# Altium schematic sheet FRONT_LCD.SchDoc: SDR200
size 420 x 297 mm; DocumentNumber: XXXX.468179.001 Э3; SheetNumber: 3; SheetTotal: 7; Title2str: Передняя панель; DocumentType: Схема электрическая принципиальная; Scale: 1:1
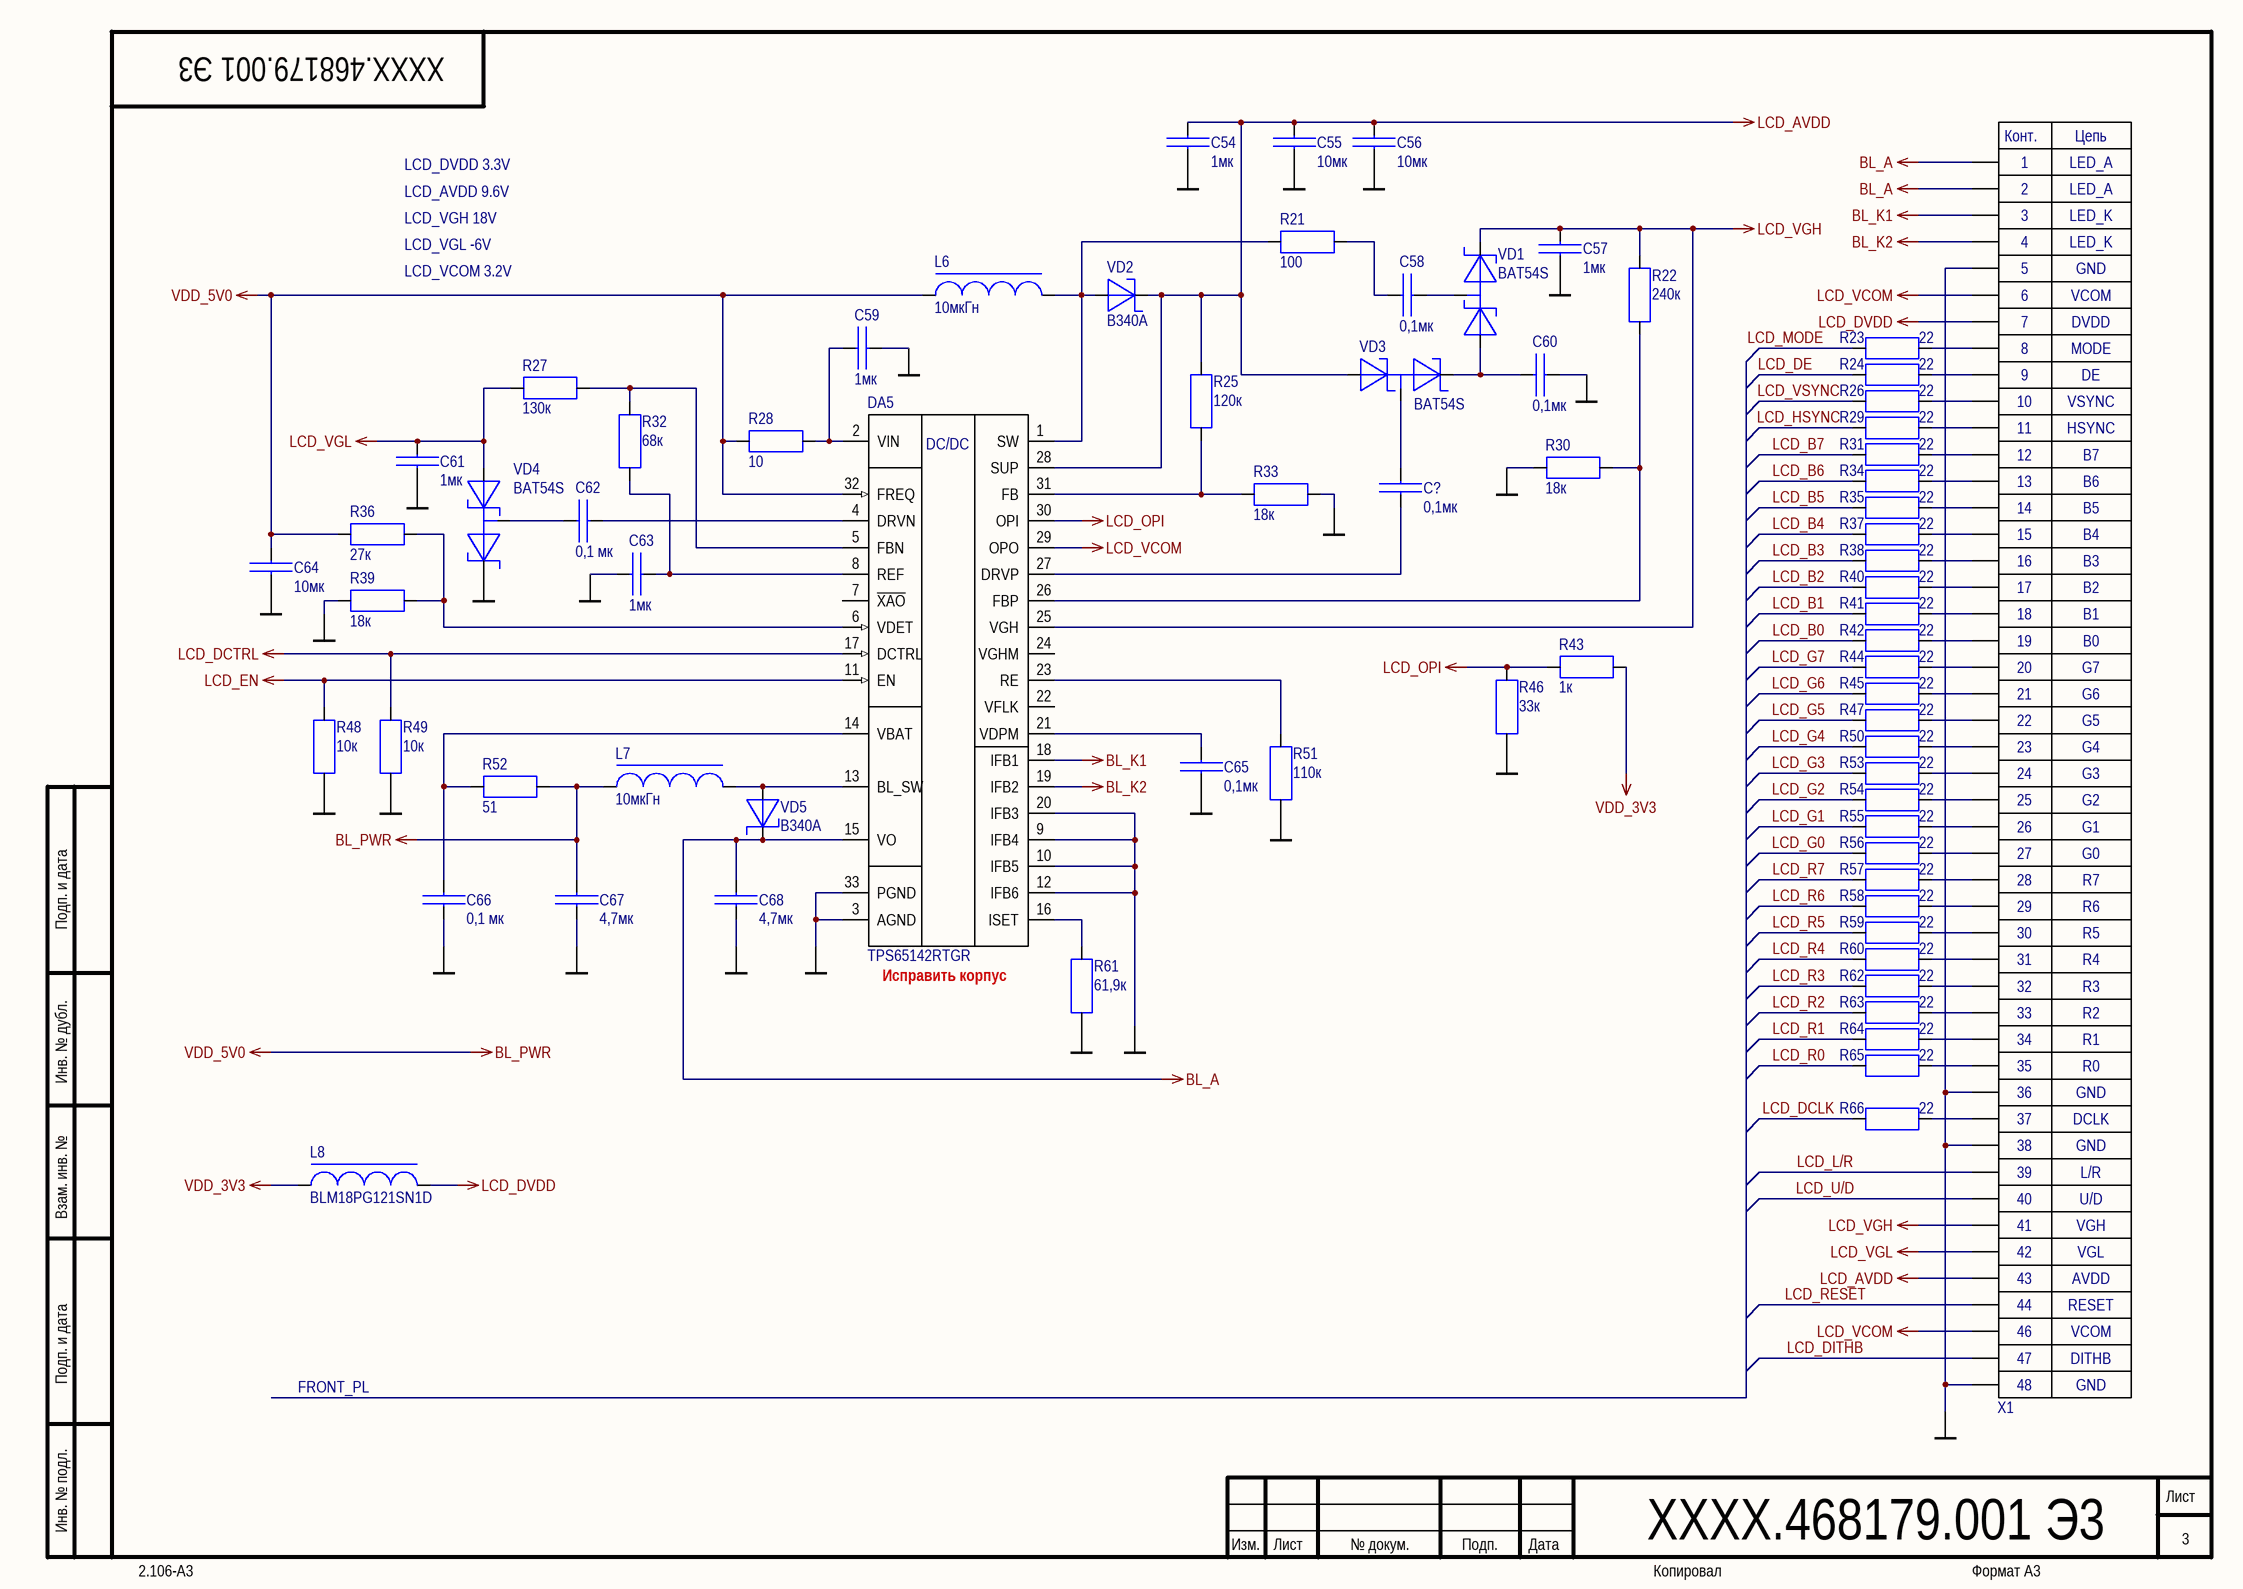
[diagram p0: FRONT_LCD.SchDoc]

## Parts
C54  Nominal: 1мк  [CAPC1608X08L]  (hidden comment: CC0603KRX7R9BB105)
C55  Nominal: 10мк  [CAPC2012X09L]  (hidden comment: CC0805KKX5R8BB106)
C56  Nominal: 10мк  [CAPC2012X09L]  (hidden comment: CC0805KKX5R8BB106)
C57  Nominal: 1мк  [CAPC1608X08L]  (hidden comment: CC0603KRX7R9BB105)
C58  Nominal: 0,1мк  [CAPC1608X08L]  (hidden comment: CC0603KRX7R9BB103)
C59  Nominal: 1мк  [CAPC1608X08L]  (hidden comment: CC0603KRX7R9BB105)
C60  Nominal: 0,1мк  [CAPC1608X08L]  (hidden comment: CC0603KRX7R9BB103)
C61  Nominal: 1мк  [CAPC1608X08L]  (hidden comment: CC0603KRX7R9BB105)
C62  Nominal: 0,1 мк  [CAPC1005X05L]  (hidden comment: CC0402KRX5R6BB104)
C63  Nominal: 1мк  [CAPC1608X08L]  (hidden comment: CC0603KRX7R9BB105)
C64  Nominal: 10мк  [CAPC2012X09L]  (hidden comment: CC0805KKX5R8BB106)
C65  Nominal: 0,1мк  [CAPC1608X08L]  (hidden comment: CC0603KRX7R9BB103)
C66  Nominal: 0,1 мк  [CAPC1005X05L]  (hidden comment: CC0402KRX5R6BB104)
C67  Nominal: 4,7мк  [CAPC2012X09L]  (hidden comment: CC0805KKX7R8BB475)
C68  Nominal: 4,7мк  [CAPC2012X09L]  (hidden comment: CC0805KKX7R8BB475)
C?  Nominal: 0,1мк  [CAPC1608X08L]  (hidden comment: CC0603KRX7R9BB103)
DA5  TPS65142RTGR  [PQFN40P600X300X80_HS-33N]
L6  Nominal: 10мкГн  [INDC1812PS]  (hidden comment: 1812PS-103KR)
L7  Nominal: 10мкГн  [INDC1812PS]  (hidden comment: 1812PS-103KR)
L8  BLM18PG121SN1D  [INDC1608X05L]
R21  Nominal: 100  [RESC1005X04L]  (hidden comment: RC0402JR-07100RL)
R22  Nominal: 240к  [RESC1005X04L]  (hidden comment: RC0402JR-07240KL)
R23  Nominal: 22  [RESC1005X04L]  (hidden comment: RC0402JR-0722RL)
R24  Nominal: 22  [RESC1005X04L]  (hidden comment: RC0402JR-0722RL)
R25  Nominal: 120к  [RESC1005X04L]  (hidden comment: RC0402JR-07120KL)
R26  Nominal: 22  [RESC1005X04L]  (hidden comment: RC0402JR-0722RL)
R27  Nominal: 130к  [RESC1005X04L]  (hidden comment: RC0402JR-07130KL)
R28  Nominal: 10  [RESC1005X04L]  (hidden comment: RC0402JR-0710RL)
R29  Nominal: 22  [RESC1005X04L]  (hidden comment: RC0402JR-0722RL)
R30  Nominal: 18к  [RESC1005X04L]  (hidden comment: RC0402JR-0718KL)
R31  Nominal: 22  [RESC1005X04L]  (hidden comment: RC0402JR-0722RL)
R32  Nominal: 68к  [RESC1005X04L]  (hidden comment: RC0402JR-0768KL)
R33  Nominal: 18к  [RESC1005X04L]  (hidden comment: RC0402JR-0718KL)
R34  Nominal: 22  [RESC1005X04L]  (hidden comment: RC0402JR-0722RL)
R35  Nominal: 22  [RESC1005X04L]  (hidden comment: RC0402JR-0722RL)
R36  Nominal: 27к  [RESC1005X04L]  (hidden comment: RC0402JR-0727KL)
R37  Nominal: 22  [RESC1005X04L]  (hidden comment: RC0402JR-0722RL)
R38  Nominal: 22  [RESC1005X04L]  (hidden comment: RC0402JR-0722RL)
R39  Nominal: 18к  [RESC1005X04L]  (hidden comment: RC0402JR-0718KL)
R40  Nominal: 22  [RESC1005X04L]  (hidden comment: RC0402JR-0722RL)
R41  Nominal: 22  [RESC1005X04L]  (hidden comment: RC0402JR-0722RL)
R42  Nominal: 22  [RESC1005X04L]  (hidden comment: RC0402JR-0722RL)
R43  Nominal: 1к  [RESC1005X04L]  (hidden comment: RC0402JR-071KL)
R44  Nominal: 22  [RESC1005X04L]  (hidden comment: RC0402JR-0722RL)
R45  Nominal: 22  [RESC1005X04L]  (hidden comment: RC0402JR-0722RL)
R46  Nominal: 33к  [RESC1005X04L]  (hidden comment: RC0402JR-0733KL)
R47  Nominal: 22  [RESC1005X04L]  (hidden comment: RC0402JR-0722RL)
R48  Nominal: 10к  [RESC1005X04L]  (hidden comment: RC0402JR-0710KL)
R49  Nominal: 10к  [RESC1005X04L]  (hidden comment: RC0402JR-0710KL)
R50  Nominal: 22  [RESC1005X04L]  (hidden comment: RC0402JR-0722RL)
R51  Nominal: 110к  [RESC1005X04L]  (hidden comment: RC0402JR-07110KL)
R52  Nominal: 51  [RESC1005X04L]  (hidden comment: RC0402JR-0751RL)
R53  Nominal: 22  [RESC1005X04L]  (hidden comment: RC0402JR-0722RL)
R54  Nominal: 22  [RESC1005X04L]  (hidden comment: RC0402JR-0722RL)
R55  Nominal: 22  [RESC1005X04L]  (hidden comment: RC0402JR-0722RL)
R56  Nominal: 22  [RESC1005X04L]  (hidden comment: RC0402JR-0722RL)
R57  Nominal: 22  [RESC1005X04L]  (hidden comment: RC0402JR-0722RL)
R58  Nominal: 22  [RESC1005X04L]  (hidden comment: RC0402JR-0722RL)
R59  Nominal: 22  [RESC1005X04L]  (hidden comment: RC0402JR-0722RL)
R60  Nominal: 22  [RESC1005X04L]  (hidden comment: RC0402JR-0722RL)
R61  Nominal: 61,9к  [RESC1005X04L]  (hidden comment: RC0402FR-0761K9L)
R62  Nominal: 22  [RESC1005X04L]  (hidden comment: RC0402JR-0722RL)
R63  Nominal: 22  [RESC1005X04L]  (hidden comment: RC0402JR-0722RL)
R64  Nominal: 22  [RESC1005X04L]  (hidden comment: RC0402JR-0722RL)
R65  Nominal: 22  [RESC1005X04L]  (hidden comment: RC0402JR-0722RL)
R66  Nominal: 22  [RESC1005X04L]  (hidden comment: RC0402JR-0722RL)
VD1  BAT54S  [SOT95P240X120-3L]
VD2  B340A  [DIOM5127X23L]
VD3  BAT54S  [SOT95P240X120-3L]
VD4  BAT54S  [SOT95P240X120-3L]
VD5  B340A  [DIOM5127X23L]
X1  LCD 50p  [CON_541325062_MOL]  (value not drawn)

## Nets
BL_A: C68.2 DA5.15(VO) VD5.1(K) X1.1 X1.2
BL_K1: DA5.18(IFB1) X1.3
BL_K2: DA5.19(IFB2) X1.4
BL_PWR: C64.1 C67.2 DA5.32(FREQ) L6.2 L7.2 R28.1 R36.1 R52.1  [also labelled VDD_5V0]
GND: C54.1 C55.2 C56.2 C57.1 C59.1 C60.2 C61.1 C63.1 C64.2 C65.1 C66.1 C67.1 C68.1 DA5.3(AGND) DA5.9(IFB4) DA5.10(IFB5) DA5.12(IFB6) DA5.20(IFB3) DA5.33(PGND) R30.1 R33.2 R39.1 R46.1 R48.2 R49.2 R51.1 R61.1 VD4.3(K) X1.5 X1.36 X1.38 X1.48
LCD_AVDD: C54.2 C55.1 C56.1 DA5.28(SUP) R25.1 VD2.1(K) VD3.2(A) X1.43
LCD_DCTRL: DA5.17(DCTRL) R49.1
LCD_DVDD: L8.1 X1.7
LCD_EN: DA5.11(EN) R48.1
LCD_OPI: DA5.30(OPI) R43.2 R46.2
LCD_VCOM: DA5.29(OPO) X1.6 X1.46
LCD_VGH: C57.2 DA5.25(VGH) R22.1 VD1.3(K) X1.41
LCD_VGL: C61.2 R27.1 VD4.2(A) X1.42
VDD_3V3: L8.2 R43.1
LCD_B0: R42.2
LCD_B1: R41.2
LCD_B2: R40.2
LCD_B3: R38.2
LCD_B4: R37.2
LCD_B5: R35.2
LCD_B6: R34.2
LCD_B7: R31.2
LCD_DCLK: R66.2
LCD_DE: R24.2
LCD_DITHB: X1.47
LCD_G0: R56.2
LCD_G1: R55.2
LCD_G2: R54.2
LCD_G3: R53.2
LCD_G4: R50.2
LCD_G5: R47.2
LCD_G6: R45.2
LCD_G7: R44.2
LCD_HSYNC: R29.2
LCD_L/R: X1.39
LCD_MODE: R23.2
LCD_R0: R65.2
LCD_R1: R64.2
LCD_R2: R63.2
LCD_R3: R62.2
LCD_R4: R60.2
LCD_R5: R59.2
LCD_R6: R58.2
LCD_R7: R57.2
LCD_RESET: X1.44
LCD_U/D: X1.40
LCD_VSYNC: R26.2
NetC58_1: C58.1 R21.1
NetC58_2: C58.2 VD1.1
NetC59_2: C59.2 DA5.2(VIN) R28.2
NetC60_1: C60.1 VD1.2(A) VD3.3(K)
NetC62_1: C62.1 DA5.4(DRVN)
NetC62_2: C62.2 VD4.1
NetC63_2: C63.2 DA5.8(REF) R32.1
NetC65_2: C65.2 DA5.21(VDPM)
NetC66_2: C66.2 DA5.14(VBAT) R52.2
NetC?_1: C?.1 DA5.27(DRVP)
NetC?_2: C?.2 VD3.1
NetDA5_1: DA5.1(SW) L6.1 R21.2 VD2.2(A)
NetDA5_5: DA5.5(FBN) R27.2 R32.2
NetDA5_6: DA5.6(VDET) R36.2 R39.2
NetDA5_13: DA5.13(BL_SW) L7.1 VD5.2(A)
NetDA5_16: DA5.16(ISET) R61.2
NetDA5_23: DA5.23(RE) R51.2
NetDA5_26: DA5.26(FBP) R22.2 R30.2
NetDA5_31: DA5.31(FB) R25.2 R33.1
NetR23_1: R23.1 X1.8
NetR24_1: R24.1 X1.9
NetR26_1: R26.1 X1.10
NetR29_1: R29.1 X1.11
NetR31_1: R31.1 X1.12
NetR34_1: R34.1 X1.13
NetR35_1: R35.1 X1.14
NetR37_1: R37.1 X1.15
NetR38_1: R38.1 X1.16
NetR40_1: R40.1 X1.17
NetR41_1: R41.1 X1.18
NetR42_1: R42.1 X1.19
NetR44_1: R44.1 X1.20
NetR45_1: R45.1 X1.21
NetR47_1: R47.1 X1.22
NetR50_1: R50.1 X1.23
NetR53_1: R53.1 X1.24
NetR54_1: R54.1 X1.25
NetR55_1: R55.1 X1.26
NetR56_1: R56.1 X1.27
NetR57_1: R57.1 X1.28
NetR58_1: R58.1 X1.29
NetR59_1: R59.1 X1.30
NetR60_1: R60.1 X1.31
NetR62_1: R62.1 X1.32
NetR63_1: R63.1 X1.33
NetR64_1: R64.1 X1.34
NetR65_1: R65.1 X1.35
NetR66_1: R66.1 X1.37

Not connected (* = marked no-connect by the designer): DA5 7(~{XAO}) 22(VFLK) 24(VGHM)

## Notes on the sheet
- LCD_DVDD 3.3V
- LCD_AVDD 9.6V
- LCD_VGH 18V
- LCD_VGL -6V
- LCD_VCOM 3.2V
- Исправить корпус
- FRONT_PL
- Подп. и дата
- Инв. № дубл.
- Взам. инв. №
- Инв. № подл.
- Изм.
- Лист
- № докум.
- Подп.
- Дата
- 2.106-A3
- Копировал
- Формат А3
- (in symbol LCD 50p) Конт.; Цепь; LED_A; LED_K; GND; VCOM; DVDD; MODE; DE; VSYNC; HSYNC; B7; B6; B5; B4; B3; B2; B1; B0; G7; G6; G5; G4; G3; G2; G1; G0; R7; R6; R5; R4; R3; R2; R1; R0; DCLK; L/R; U/D; VGH; VGL; AVDD; RESET; DITHB
- (in symbol TPS65142RTGR) DC/DC

## Library data of the parts
C54 C57 C59 C61 C63 = CC0603KRX7R9BB105: ЧИП конденсатор; Manufacturer: Yageo; ID: 0603 1 мкФ 50В X7R; Tolerance: 10%; Type: X7R; Value: 0603 1 мкФ 50В X7R; RuNominal: 1 мкФ; Voltage: 50В; ManufacturerPartNumber: CC0603KRX7R9BB105; Rem: *
C55 C56 C64 = CC0805KKX5R8BB106: ЧИП конденсатор; Manufacturer: Yageo; ID: 0805 10 мкФ 25В X7R; Tolerance: 0,1; Type: X7R; Value: 0805 10 мкФ 25В X7R; RuNominal: 10 мкФ; Voltage: 25В; ManufacturerPartNumber: CC0805KKX5R8BB106; Rem: *
C58 C60 C65 C? = CC0603KRX7R9BB103: ЧИП конденсатор; Manufacturer: Yageo; ID: 0603 0,1 мкФ 50В X7R; Tolerance: 10%; Type: X7R; Value: 0603 0,1 мкФ 50В X7R; RuNominal: 0,1 мкФ; Voltage: 50В; ManufacturerPartNumber: CC0603KRX7R9BB103; Rem: *
C62 C66 = CC0402KRX5R6BB104: ЧИП конденсатор; Manufacturer: Yageo; ID: 0402 0,1 мкФ 10В X7R; Tolerance: 10%; Type: X7R; Value: 0402 0,1 мкФ 10В X7R; RuNominal: 0,1 мкФ; Voltage: 10В; ManufacturerPartNumber: CC0402KRX5R6BB104; Rem: *
C67 C68 = CC0805KKX7R8BB475: ЧИП конденсатор; Manufacturer: Yageo; ID: 0805 4,7 мкФ 25В X7R; Tolerance: 0,1; Type: X7R; Value: 0805 4,7 мкФ 25В X7R; RuNominal: 4,7 мкФ; Voltage: 25В; ManufacturerPartNumber: CC0805KKX7R8BB475; Rem: *
DA5 = TPS65142RTGR: LCD Bias Power Integrated with WLED Backlight Drivers; Manufacturer: TI; Value: TPS65142RTGR; ComponentLink1Description: datasheet; ComponentLink1URL: https://www.ti.com/lit/ds/symlink/tps65142.pdf?ts=1769084662005&ref_url=https%253A%252F%252Fwww.ti.com%252Fproduct%252FTPS65142; ManufacturerPartNumber: TPS65142RTGR; Rem: *
L6 L7 = 1812PS-103KR: Shielded High SRF Inductors; Manufacturer: Coilcraft; ID: 1812PS 10мкГн 10%; Rem: 10%; Value: 1812PS 10мкГн 10%; Current: 0,9А; DC Res: 0.17; ManufacturerPartNumber: 1812PS-103KR
L8 = BLM18PG121SN1D: Chip Ferrite Beads (0603 Size); Manufacturer: Murata; Rem: 120ohm ±25%; Current: 2000mA; DC Res: 0.05ohm; Nominal: BLM18PG121SN1D; ID: BLM18PG121SN1D; ManufacturerPartNumber: BLM18PG121SN1D; Value: BLM18PG121SN1D
R21 = RC0402JR-07100RL: ЧИП резистор; Manufacturer: Yageo; ID: 0402 100 Ом 5%; Tolerance: 5%; Value: 0402 100 Ом 5%; ManufacturerPartNumber: RC0402JR-07100RL; Rem: *; Type: *
R22 = RC0402JR-07240KL: ЧИП резистор; Manufacturer: Yageo; ID: 0402 240 кОм 5%; Tolerance: 5%; Value: 0402 240 кОм 5%; ManufacturerPartNumber: RC0402JR-07240KL; Rem: *; Type: *
R23 R24 R26 R29 R31 R34 R35 R37 R38 R40-R42 R44 R45 R47 R50 R53-R60 R62-R66 = RC0402JR-0722RL: ЧИП резистор; Manufacturer: Yageo; ID: 0402 22 Ом 5%; Tolerance: 5%; Value: 0402 22 Ом 5%; ManufacturerPartNumber: RC0402JR-0722RL; Rem: *; Type: *
R25 = RC0402JR-07120KL: ЧИП резистор; Manufacturer: Yageo; ID: 0402 120 кОм 5%; Tolerance: 5%; Value: 0402 120 кОм 5%; ManufacturerPartNumber: RC0402JR-07120KL; Rem: *; Type: *
R27 = RC0402JR-07130KL: ЧИП резистор; Manufacturer: Yageo; ID: 0402 130 кОм 5%; Tolerance: 5%; Value: 0402 130 кОм 5%; ManufacturerPartNumber: RC0402JR-07130KL; Rem: *; Type: *
R28 = RC0402JR-0710RL: ЧИП резистор; Manufacturer: Yageo; ID: 0402 10 Ом 5%; Tolerance: 5%; Value: 0402 10 Ом 5%; ManufacturerPartNumber: RC0402JR-0710RL; Rem: *; Type: *
R30 R33 R39 = RC0402JR-0718KL: ЧИП резистор; Manufacturer: Yageo; ID: 0402 18 кОм 5%; Tolerance: 5%; Value: 0402 18 кОм 5%; ManufacturerPartNumber: RC0402JR-0718KL; Rem: *; Type: *
R32 = RC0402JR-0768KL: ЧИП резистор; Manufacturer: Yageo; ID: 0402 68 кОм 5%; Tolerance: 5%; Value: 0402 68 кОм 5%; ManufacturerPartNumber: RC0402JR-0768KL; Rem: *; Type: *
R36 = RC0402JR-0727KL: ЧИП резистор; Manufacturer: Yageo; ID: 0402 27 кОм 5%; Tolerance: 5%; Value: 0402 27 кОм 5%; ManufacturerPartNumber: RC0402JR-0727KL; Rem: *; Type: *
R43 = RC0402JR-071KL: ЧИП резистор; Manufacturer: Yageo; ID: 0402 1 кОм 5%; Tolerance: 5%; Value: 0402 1 кОм 5%; ManufacturerPartNumber: RC0402JR-071KL; Rem: *; Type: *
R46 = RC0402JR-0733KL: ЧИП резистор; Manufacturer: Yageo; ID: 0402 33 кОм 5%; Tolerance: 5%; Value: 0402 33 кОм 5%; ManufacturerPartNumber: RC0402JR-0733KL; Rem: *; Type: *
R48 R49 = RC0402JR-0710KL: ЧИП резистор; Manufacturer: Yageo; ID: 0402 10 кОм 5%; Tolerance: 5%; Value: 0402 10 кОм 5%; ManufacturerPartNumber: RC0402JR-0710KL; Rem: *; Type: *
R51 = RC0402JR-07110KL: ЧИП резистор; Manufacturer: Yageo; ID: 0402 110 кОм 5%; Tolerance: 5%; Value: 0402 110 кОм 5%; ManufacturerPartNumber: RC0402JR-07110KL; Rem: *; Type: *
R52 = RC0402JR-0751RL: ЧИП резистор; Manufacturer: Yageo; ID: 0402 51 Ом 5%; Tolerance: 5%; Value: 0402 51 Ом 5%; ManufacturerPartNumber: RC0402JR-0751RL; Rem: *; Type: *
R61 = RC0402FR-0761K9L: ЧИП резистор; Manufacturer: Yageo; ID: 0402 61,9 кОм 1%; Tolerance: 1%; Value: 0402 61,9 кОм 1%; ManufacturerPartNumber: RC0402FR-0761K9L; Rem: *; Type: *
VD1 VD3 VD4 = BAT54S: SCHOTTKY DIODE; Manufacturer: International Rectifier; Rem: 0.2Amp 30V; Value: BAT54S; ID: BAT54S; ManufacturerPartNumber: BAT54S; datasheet: https://static.chipdip.ru/lib/196/DOC000196695.pdf
VD2 VD5 = B340A: High-Current Density Surface Mount Schottky Rectifier; Manufacturer: Vishay; Rem: 3Amp 40V; Value: B340A; ID: B340A; ManufacturerPartNumber: B340A; datasheet: https://static.chipdip.ru/lib/652/DOC001652710.pdf